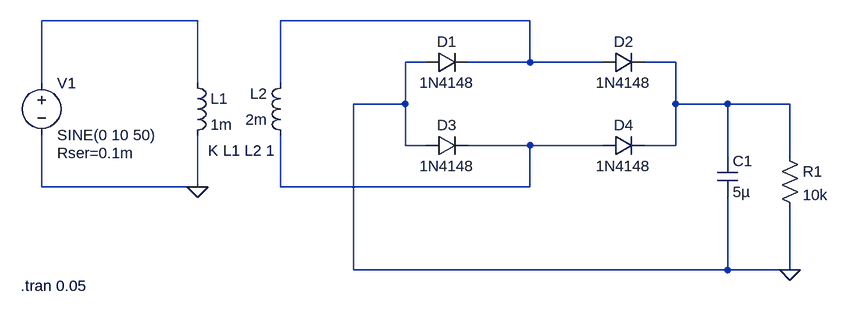
[diagram p0: schematic Full_Wave_Rectifier.asc]
Full_Wave_Rectifier.asc, the LTspice schematic file:
Version 4.1
SHEET 1 880 680
WIRE -272 -16 -512 -16
WIRE 240 -16 -144 -16
WIRE 80 48 48 48
WIRE 240 48 240 -16
WIRE 240 48 144 48
WIRE 352 48 240 48
WIRE 464 48 416 48
WIRE -512 80 -512 -16
WIRE -272 80 -272 -16
WIRE -144 80 -144 -16
WIRE 48 112 48 48
WIRE 48 112 -32 112
WIRE 464 112 464 48
WIRE 544 112 464 112
WIRE 640 112 544 112
WIRE 48 176 48 112
WIRE 80 176 48 176
WIRE 240 176 144 176
WIRE 352 176 240 176
WIRE 464 176 464 112
WIRE 464 176 416 176
WIRE 544 192 544 112
WIRE 640 192 640 112
WIRE -512 240 -512 160
WIRE -272 240 -272 160
WIRE -272 240 -512 240
WIRE -144 240 -144 160
WIRE 240 240 240 176
WIRE 240 240 -144 240
WIRE -32 368 -32 112
WIRE 544 368 544 256
WIRE 544 368 -32 368
WIRE 640 368 640 272
WIRE 640 368 544 368
FLAG 640 368 0
FLAG -272 240 0
SYMBOL diode 80 32 M90
WINDOW 0 0 32 VBottom 2
WINDOW 3 32 32 VTop 2
SYMATTR InstName D1
SYMATTR Value 1N4148
SYMBOL diode 352 32 M90
WINDOW 0 0 32 VBottom 2
WINDOW 3 32 32 VTop 2
SYMATTR InstName D2
SYMATTR Value 1N4148
SYMBOL diode 80 160 M90
WINDOW 0 0 32 VBottom 2
WINDOW 3 32 32 VTop 2
SYMATTR InstName D3
SYMATTR Value 1N4148
SYMBOL diode 352 160 M90
WINDOW 0 0 32 VBottom 2
WINDOW 3 32 32 VTop 2
SYMATTR InstName D4
SYMATTR Value 1N4148
SYMBOL ind -288 64 R0
SYMATTR InstName L1
SYMATTR Value 1m
SYMATTR Type ind
SYMBOL voltage -512 64 R0
WINDOW 123 0 0 Left 0
WINDOW 39 24 124 Left 2
SYMATTR InstName V1
SYMATTR Value SINE(0 10 50)
SYMATTR SpiceLine Rser=0.1m
SYMBOL res 624 176 R0
SYMATTR InstName R1
SYMATTR Value 10k
SYMBOL cap 528 192 R0
SYMATTR InstName C1
SYMATTR Value 5µ
SYMBOL ind -128 176 R180
WINDOW 0 36 80 Left 2
WINDOW 3 36 40 Left 2
SYMATTR InstName L2
SYMATTR Value 2m
SYMATTR Type ind
TEXT -544 392 Left 2 !.tran 0.05
TEXT -256 184 Left 2 !K L1 L2 1

The netlist it stands for:
* Full_Wave_Rectifier.asc
D1 0 N002 1N4148
D2 N002 N003 1N4148
D3 0 N004 1N4148
D4 N004 N003 1N4148
L1 N001 0 1m
V1 N001 0 SINE(0 10 50) Rser=0.1m
R1 N003 0 10k
C1 N003 0 5µ
L2 N004 N002 2m
.model D D
.lib standard.dio
.tran 0.05
K L1 L2 1
.backanno
.end